# Altium schematic sheet 1_bootleg-ev_top.SchDoc: =ProjectTitle
size A4; Address1: github.com/4pplet/bootlegs; Address2: Licence: CERN-OHL-S; Address4: www.4pplet.com; SheetNumber: 1; SheetTotal: 4; ProjectName: waffling60
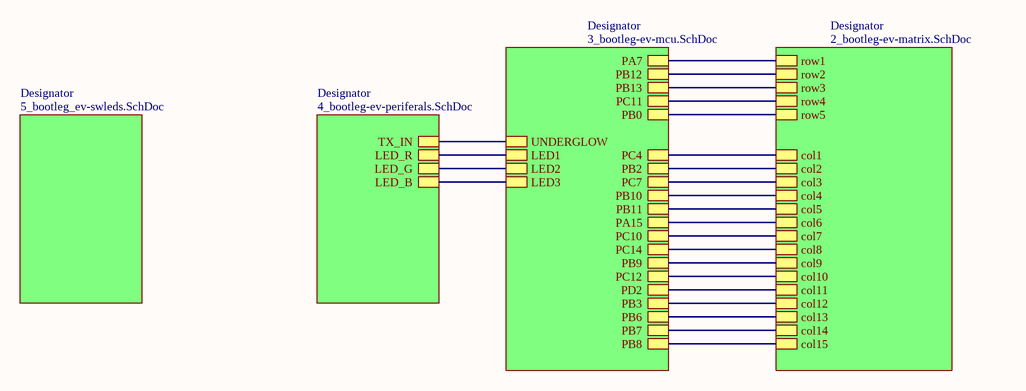
[diagram p0: 1_bootleg-ev_top.SchDoc]

## Sub-sheets
Designator = 3_bootleg-ev-mcu.SchDoc: PB10, PB3, PB8, PB9, PC10, PB0, PC11, PB7, PA15, PB6, PC14, PB13, PD2, UNDERGLOW, LED2, LED1, LED3, PC12, PB2, PB12, PB11, PA7, PC7, PC4
Designator = 2_bootleg-ev-matrix.SchDoc: col5, col7, col3, col1, row3, row1, row4, row2, row5, col4, col2, col6, col14, col10, col8, col9, col15, col11, col12, col13
Designator = 4_bootleg-ev-periferals.SchDoc: TX_IN, LED_B, LED_R, LED_G
Designator = 5_bootleg_ev-swleds.SchDoc: no entries

## Nets
(unnamed): sheet Designator/PB10, sheet Designator/col4
(unnamed): sheet Designator/PB3, sheet Designator/col12
(unnamed): sheet Designator/PB8, sheet Designator/col15
(unnamed): sheet Designator/PB9, sheet Designator/col9
(unnamed): sheet Designator/PC10, sheet Designator/col7
(unnamed): sheet Designator/PB0, sheet Designator/row5
(unnamed): sheet Designator/PC11, sheet Designator/row4
(unnamed): sheet Designator/PB7, sheet Designator/col14
(unnamed): sheet Designator/PA15, sheet Designator/col6
(unnamed): sheet Designator/PB6, sheet Designator/col13
(unnamed): sheet Designator/PC14, sheet Designator/col8
(unnamed): sheet Designator/PB13, sheet Designator/row3
(unnamed): sheet Designator/PD2, sheet Designator/col11
(unnamed): sheet Designator/UNDERGLOW, sheet Designator/TX_IN
(unnamed): sheet Designator/LED2, sheet Designator/LED_G
(unnamed): sheet Designator/LED1, sheet Designator/LED_R
(unnamed): sheet Designator/LED3, sheet Designator/LED_B
(unnamed): sheet Designator/PC12, sheet Designator/col10
(unnamed): sheet Designator/PB2, sheet Designator/col2
(unnamed): sheet Designator/PB12, sheet Designator/row2
(unnamed): sheet Designator/PB11, sheet Designator/col5
(unnamed): sheet Designator/PA7, sheet Designator/row1
(unnamed): sheet Designator/PC7, sheet Designator/col3
(unnamed): sheet Designator/PC4, sheet Designator/col1

## Notes on the sheet
- Title
- Size:
- Date:
- A4
- Number:
- Time:
- Revision:
- Sheet
- of
- File: